# EAGLE design mush_indi_gnat (EAGLE 9.6.2)
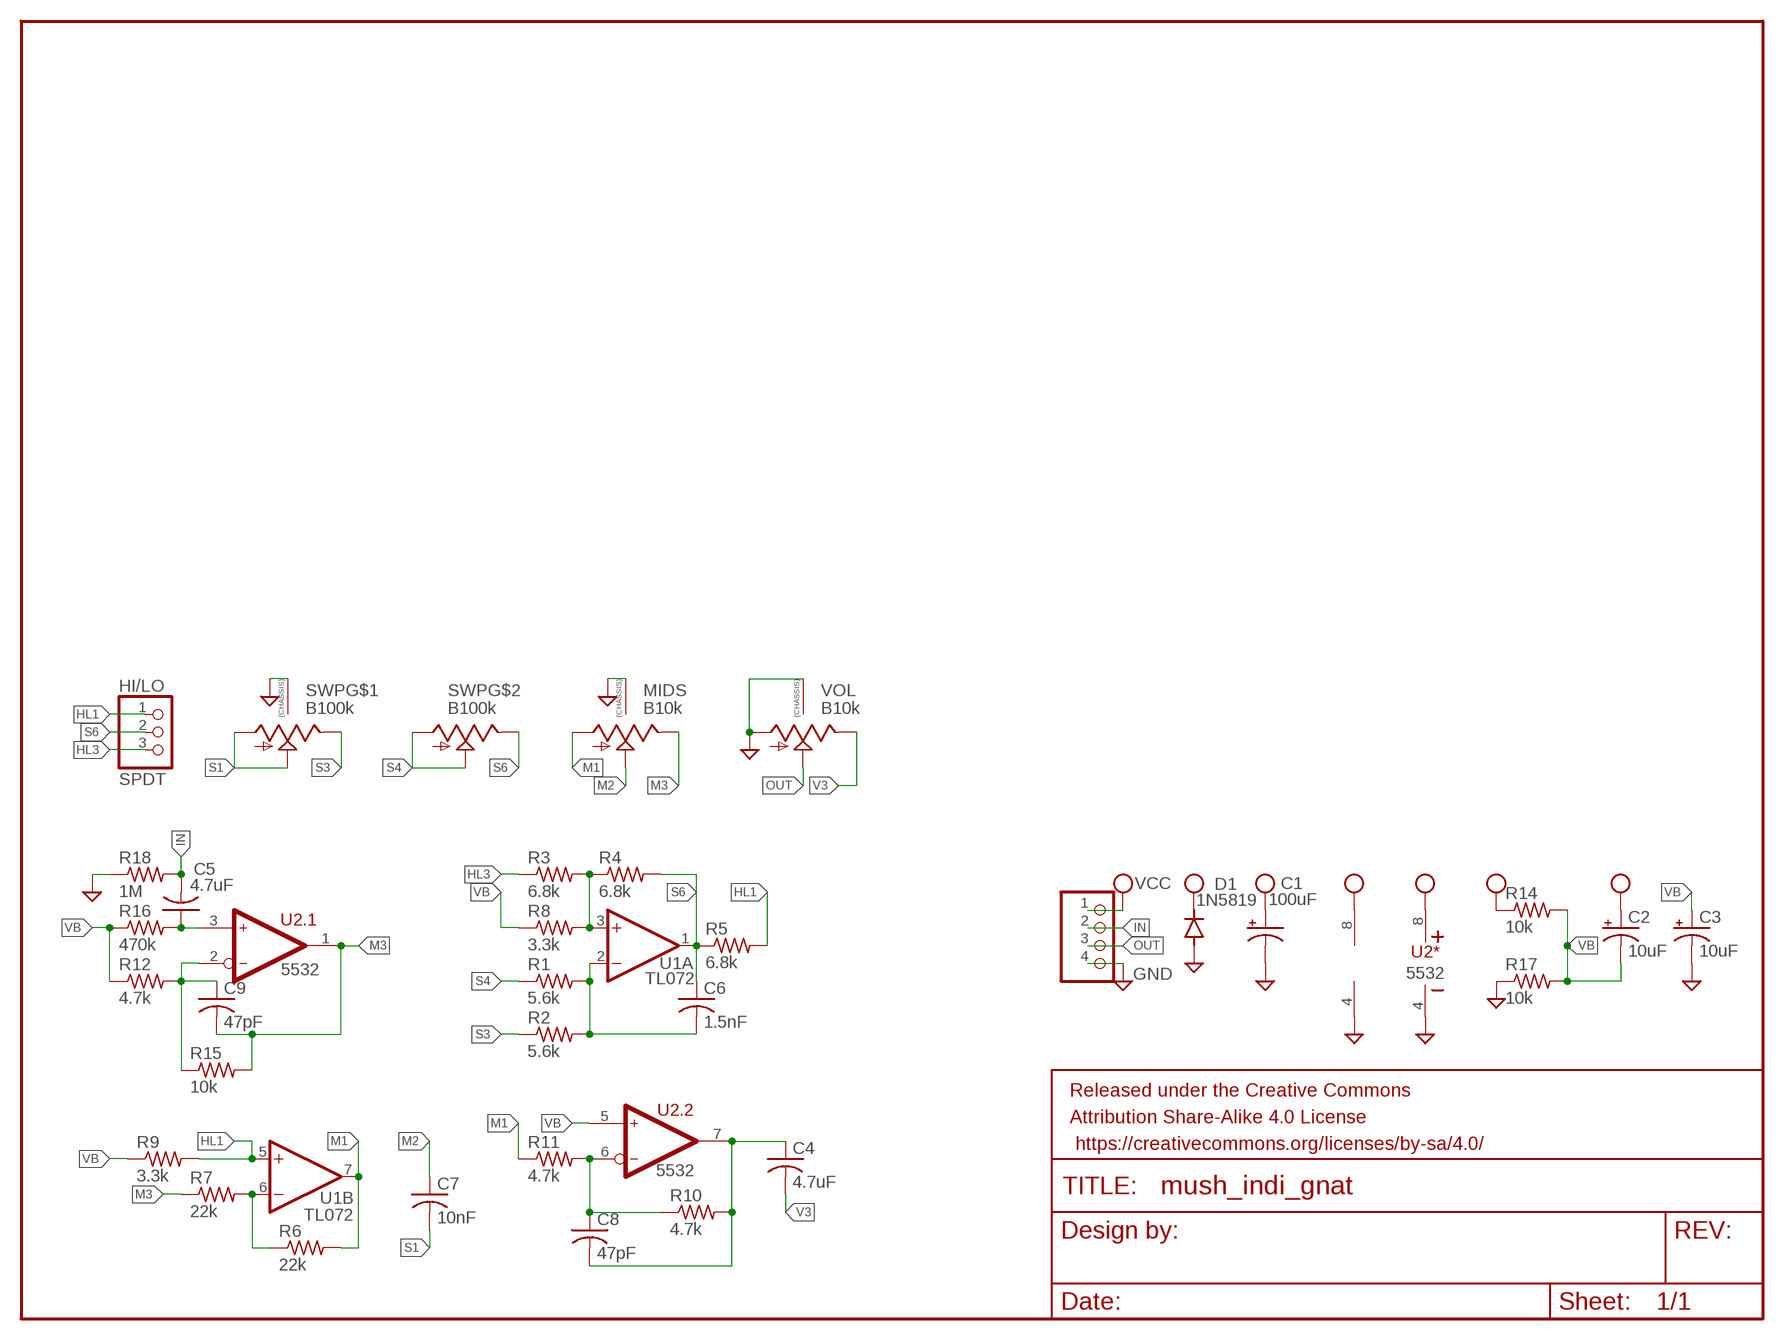
[diagram p0: schematic, sheet 1]

## Parts
C1  100uF  CAP_SMD+THRUPAN_B  [PAN_B_SMD+THRU]
C2  10uF  C-POL-US_TANTALUM-1206(3216-METRIC)  [CAPMP3216X180N]
C3  10uF  C-POL-US_TANTALUM-1206(3216-METRIC)  [CAPMP3216X180N]
C4  4.7uF  C-USC0805  [C0805]
C5  4.7uF  C-USC0805  [C0805]
C6  1.5nF  C-USC0603  [C0603]
C7  10nF  C-USC0603  [C0603]
C8  47pF  C-USC0603  [C0603]
C9  47pF  C-USC0603  [C0603]
D1  1N5819  DIODE-SOD123  [SOD123]
FRAME1  FRAME-LETTERNO_PACKAGE  [DUMMY]
HI/LO  SPDT  PINHD-1X3  [1X03]
JP1  PINHD-1X4  [1X04]
MIDS  B10k  9MM_SNAP-IN_POT_CHASSIS  [9MM_SNAP-IN_POT]
R1  5.6k  R-US_R0603  [R0603]
R2  5.6k  R-US_R0603  [R0603]
R3  6.8k  R-US_R0603  [R0603]
R4  6.8k  R-US_R0603  [R0603]
R5  6.8k  R-US_R0603  [R0603]
R6  22k  R-US_R0603  [R0603]
R7  22k  R-US_R0603  [R0603]
R8  3.3k  R-US_R0603  [R0603]
R9  3.3k  R-US_R0603  [R0603]
R10  4.7k  R-US_R0603  [R0603]
R11  4.7k  R-US_R0603  [R0603]
R12  4.7k  R-US_R0603  [R0603]
R14  10k  R-US_R0603  [R0603]
R15  10k  R-US_R0603  [R0603]
R16  470k  R-US_R0603  [R0603]
R17  10k  R-US_R0603  [R0603]
R18  1M  R-US_R0603  [R0603]
SWP  B100k  ALPHA-9MM-DUALPOT  [DUAL_9MM_SNAP-IN_POT]
U1  TL072  TL072TSSOP  [TSSOP-8]
U2  5532  NJM5532M  [SO-8]
VOL  B10k  9MM_SNAP-IN_POT_CHASSIS  [9MM_SNAP-IN_POT]

## Nets
GND: C1.- C1.--(-) C3.2(-) D1.A JP1.4 MIDS.CHASSIS1 MIDS.CHASSIS2 R17.1 R18.1 SWP.CHASSIS1 SWP.CHASSIS2 U1.4(P:V-) U2.4(*:V-) VOL.1(A) VOL.CHASSIS1 VOL.CHASSIS2
HL1: HI/LO.1 R5.2 R9.2 U1.5(B:+IN)
HL3: HI/LO.3 R3.1
IN: C5.2 JP1.2 R18.2
M1: MIDS.1(A) R6.2 R11.1 U1.7(B:OUT)
M2: C7.1 MIDS.2(S)
M3: C9.2 MIDS.3(E) R7.1 R15.2 U2.1(.1:OUT)
N$2: C5.1 R16.2 U2.3(.1:IN+)
N$3: C9.1 R12.2 R15.1 U2.2(.1:IN-)
N$4: R6.1 R7.2 U1.6(B:-IN)
N$5: R3.2 R4.1 R8.2 U1.3(A:+IN)
N$6: C6.2 R1.2 R2.2 U1.2(A:-IN)
N$7: C8.1 R10.1 R11.2 U2.6(.2:IN-)
N$8: C4.1 C8.2 R10.2 U2.7(.2:OUT)
OUT: JP1.3 VOL.2(S)
S1: C7.2 SWP.1(A) SWP.2(S)
S3: R2.1 SWP.3(E)
S4: R1.1 SWP.1B(A) SWP.2B(S)
S6: C6.1 HI/LO.2 R4.2 R5.1 SWP.3B(E) U1.1(A:OUT)
V3: C4.2 VOL.3(E)
VB: C2.2(-) C3.1(+) R8.1 R9.1 R12.1 R14.2 R16.1 R17.2 U2.5(.2:IN+)
VCC: C1.+ C1.++(+) C2.1(+) D1.C JP1.1 R14.1 U1.8(P:V+) U2.8(*:V+)

## Library data of the parts
C1 = MusicThingModular:CAP_SMD+THRU
C2 C3 = Capacitor:C-POL-US: Capacitor Polarised - ANSI; CATEGORY: Capacitor
C4-C9 = adafruit:C-US: CAPACITOR, American symbol
D1 = diode:DIODE-: DIODE
FRAME1 = SparkFun-Aesthetics:FRAME-LETTER: Schematic Frame - Letter Standard 8.5x11 US Letter frame; DESIGNER: Nobody; VERSION: v01
HI/LO = pinhead:PINHD-1X3: PIN HEADER
JP1 = Connector:PINHD-1X4: PIN HEADER; CATEGORY: CONNECTOR; SUB-CATEGORY: PIN-HEADER
MIDS VOL = MusicThingModular:9MM_SNAP-IN_POT_CHASSIS: 9mm vertical snap-in pot, Alpha / Panasonic style, with a connection to the metal chassis for grounding
R1-R12 R14-R18 = adafruit:R-US_: RESISTOR, American symbol
SWP = MusicThingModular:ALPHA-9MM-DUALPOT: 9mm vertical snap-in pot, Alpha / Panasonic style, with a connection to the metal chassis for grounding
U1 = MusicThingModular:TL072: Generic Dual Op Amp
U2 = ic-jrc:NJM5532; MOUSER: 513-NJM5532M

## Board
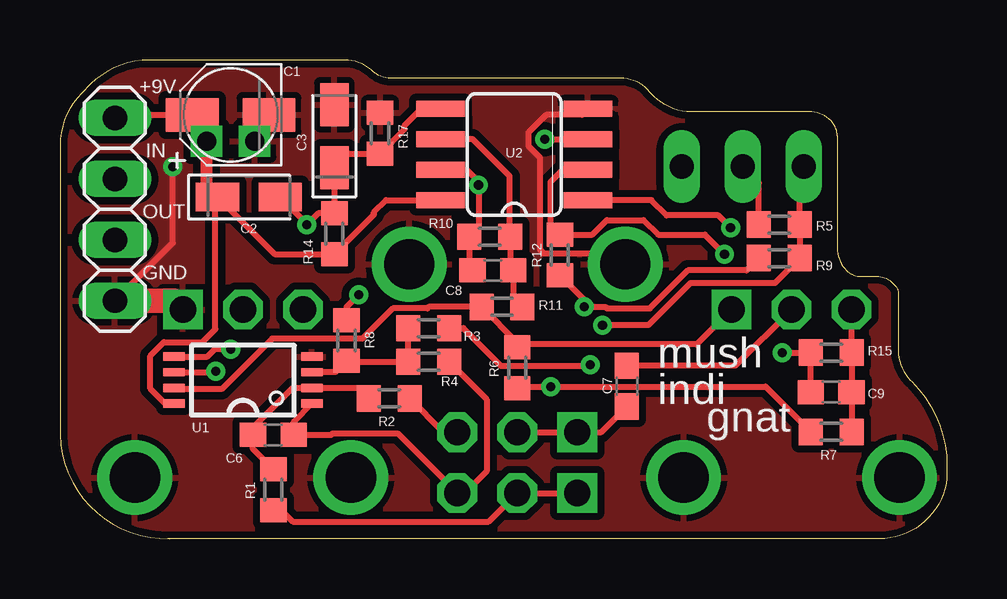
[diagram p1: board, top side]
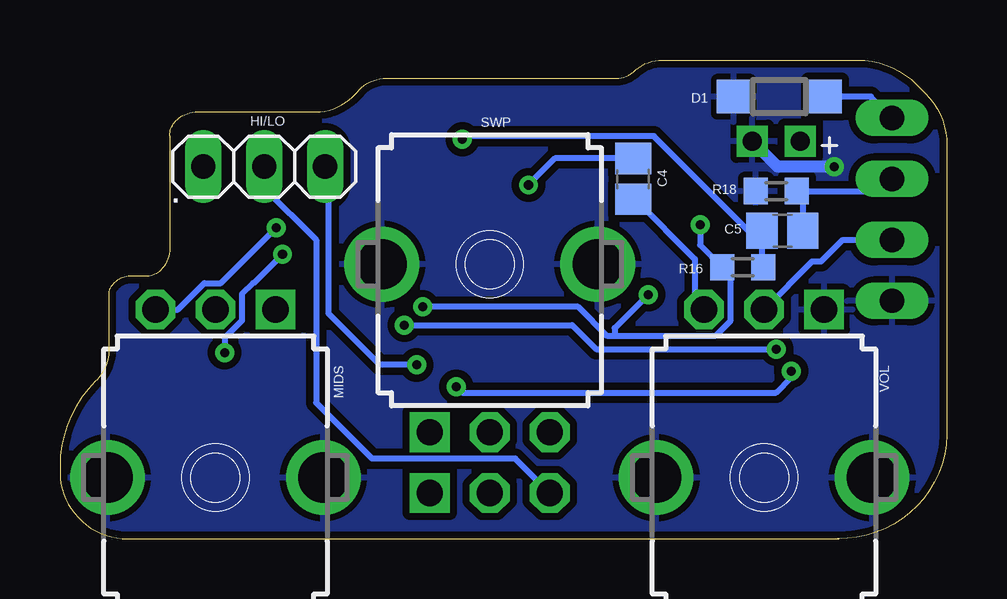
[diagram p2: board, bottom side, seen from below]

Size 36.96 x 19.94 mm. Coordinates in mm from the lower left corner, seen from the top.
Outline: 0,16.12 0,4.32
Outline: 4.5,0 34.35,0 arc45 36.2,0.89 arc45 36.96,2.73 36.96,3.01 arc45 35.49,6.54 35.43,6.6 arc-45 34.92,7.83 34.92,10.23 arc45 34.8,10.54 34.69,10.65 arc45 34.04,10.92 33.38,10.92 arc-45 32.77,11.18 arc-45 32.38,12.1 32.38,16.79 arc45 32.13,17.4 arc45 31.21,17.78 26.3,17.78 arc-45 24.77,18.41 24.58,18.6 arc45 23.5,19.18 14,19.18 arc-45 13.08,19.43 arc45 11.86,19.94 3.72,19.94 arc45 1.27,18.92 0.9,18.55 arc45 0,16.38 0,4.32
Outline: 0,4.32 arc90 4.57,0
Copper layers (1*16): Top 0.035mm / dielectric 1.5mm / Bottom 0.035mm
Design rules "default *": minimum track width 6mil, minimum drill 0.35mm, track to track 6mil, track to pad 6mil, pad to pad 6mil, via to via 6mil, smd to smd 6mil, copper to edge 10mil, drill to drill 6mil, minimum pad ring 10mil, minimum via ring 8mil, stop-mask expansion 4mil, vias tented up to drill 0mil, thermal gap 10mil

### Footprints (pad centres in the part's own frame; a part is rotated, then mirrored left to right if it is on the bottom)
PAN_B_SMD+THRU = smd 2.2 x 1.4: + 1.6,0; - -1.6,0 | drill 0.8 pad 0.9 square: ++ 1,1.1; -- -1,1.1
CAPMP3216X180N = smd 1.796 x 1.189: 1 -1.31,0; 2 1.31,0
C0805 = smd 1.3 x 1.5: 1 -0.85,0; 2 0.85,0
C0603 = smd 1.1 x 1: 1 -0.85,0; 2 0.85,0
SOD123 = smd 1.4 x 1.4: A 1.9,0; C -1.9,0
1X03 = drill 1.016 long: 1 -2.54,0; 2 0,0; 3 2.54,0
1X04 = drill 1.016 long: 1 -3.81,0; 2 -1.27,0; 3 1.27,0; 4 3.81,0
9MM_SNAP-IN_POT = drill 1.1 square: 1 -2.5,-7 | drill 1.1 octagon: 2 0,-7; 3 2.5,-7 | drill 2.1 pad 2.794: CHASSIS1 -4.5,0; CHASSIS2 4.5,0
R0603 = smd 1 x 1.1: 1 -0.85,0; 2 0.85,0
DUAL_9MM_SNAP-IN_POT = drill 1.1 square: 1 -2.5,-7; 1B -2.5,-9.54 | drill 1.1 octagon: 2 0,-7; 2B 0,-9.54; 3 2.5,-7; 3B 2.5,-9.54 | drill 2.1 pad 2.54: CHASSIS1 -4.5,0; CHASSIS2 4.5,0
TSSOP-8 = smd 0.9 x 0.35: 1 -2.875,0.975; 2 -2.875,0.325; 3 -2.875,-0.325; 4 -2.875,-0.975; 5 2.875,-0.975; 6 2.875,-0.325; 7 2.875,0.325; 8 2.875,0.975
SO-8 = smd 0.66 x 2.032: 1 -1.905,-3.073; 2 -0.635,-3.073; 3 0.635,-3.073; 4 1.905,-3.073; 5 1.905,3.073; 6 0.635,3.073; 7 -0.635,3.073; 8 -1.905,3.073

### Placement (x,y rotation side)
C1  7.11,17.65 180 top
C2  7.87,14.22 0 top
C3  11.43,16.76 90 top
C4  13.08,14.99 270 bottom
C5  6.86,12.83 0 bottom
C6  8.89,4.32 180 top
C7  23.62,6.35 270 top
C8  18.03,11.18 180 top
C9  32.13,6.1 0 top
D1  6.99,18.41 180 bottom
FRAME1  -20.32,-22.86 0 top  (outside the outline)
HI/LO  28.45,15.49 0 bottom
JP1  2.29,13.72 270 top
MIDS  30.48,2.54 180 bottom
R1  8.89,2.03 90 top
R2  13.72,5.84 180 top
R3  15.37,8.76 180 top
R4  15.37,7.37 0 top
R5  29.97,13.08 0 top
R6  19.05,7.11 90 top
R7  32.13,4.45 180 top
R8  11.94,8.26 270 top
R9  29.97,11.68 0 top
R10  17.91,12.57 180 top
R11  18.41,9.65 0 top
R12  20.83,11.81 90 top
R14  11.43,12.7 90 top
R15  32.13,7.75 0 top
R16  8.51,11.3 0 bottom
R17  13.34,16.89 270 top
R18  7.11,14.48 0 bottom
SWP  19.05,11.43 0 bottom
U1  7.62,6.6 180 top
U2  18.92,16 90 top
VOL  7.62,2.54 180 bottom

### Tracks (layer width: path | path; a pad name or v marks a point on that pad's centre or on a via)
GND  (via drill 0.38)
  Top 0.254: U2.4 21.74,17.65 20.26,17.65 19.52,16.92 19.52,16.36 20,15.88 20,12.04 20.16,11.88 23.1,11.88 SWP.CHASSIS1 | JP1.4 4.7,12.32 v4.7,15.49
  Top 1.016: JP1.4 4.75,9.91 VOL.1
  Bottom 0.508: v4.7,15.49 5.29,15.49 7.05,15.49 C1.--
  pour Bottom (isolate 0.305): -2.54,-1.27 39.37,-1.27 39.37,21.59 -1.27,21.59 -2.54,20.32
  pour Top (isolate 0.305): -2.54,-1.27 39.37,-1.27 39.37,21.59 -1.27,21.59 -2.54,20.32
HL1  (via drill 0.38)
  Top 0.254: HI/LO.1 30.82,15.33 R5.2 R9.2 29.78,10.64 26.27,10.64 24.51,8.89 v22.61,8.89 | v7.11,7.89 6.45,7.89 6.14,7.58 U1.5
  Bottom 0.254: v22.61,8.89 15.62,8.89 14.62,7.89 v7.11,7.89
HL3  (via drill 0.38)
  Top 0.254: R3.1 16.8,8.76 18.38,7.18 22.04,7.18 v22.1,7.24
  Bottom 0.254: HI/LO.3 25.77,15.35 25.77,9.37 23.64,7.24 v22.1,7.24
IN
  Bottom 0.254: C5.2 6.01,14.22 R18.2 2.79,14.48 JP1.2
M1
  Top 0.254: U1.7 4.8,6.22 6.73,6.22 8.83,8.33 12.6,8.33 13.87,9.59 15.31,9.59 15.37,9.65 R11.1 19.05,8.17 R6.2 19.18,8.09 26.53,8.09 MIDS.1
M2
  Top 0.254: MIDS.2 28.14,7.2 C7.1
M3  (via drill 0.38)
  Top 0.254: MIDS.3 R15.2 C9.2 R7.1 | v27.94,12.95 27.43,13.46 25.27,13.46 24.64,14.1 U2.1
  Bottom 0.254: MIDS.3 32.04,9.54 30.94,10.64 30.25,10.64 v27.94,12.95
N$2  (via drill 0.38)
  Top 0.254: v20.19,16.64 U2.3
  Bottom 0.254: v20.19,16.64 20.17,16.64 20.04,16.77 12.21,16.77 8.28,12.83 C5.1 7.71,11.35 R16.2
N$3  (via drill 0.38)
  Top 0.254: C9.1 R15.1 v30.1,7.75 | U2.2 20.95,15.37 20.45,14.86 20.45,13.04 R12.2 22.18,12.66 22.79,13.27 24.31,13.27 24.92,12.66 26.87,12.66 v27.69,11.85
  Bottom 0.254: v27.69,11.85 28.89,10.64 28.92,10.64 29.38,10.19 29.38,9.08 30.1,8.36 v30.1,7.75
N$4  (via drill 0.38)
  Top 0.254: R6.1 19.26,6.26 19.32,6.33 v20.45,6.33 29.4,6.33 R7.2 | U1.6 6.44,6.93 v6.49,6.97
  Bottom 0.254: v6.49,6.97 6.49,6.72 7.12,6.08 20.2,6.08 v20.45,6.33
N$5
  Top 0.254: R3.2 R4.1 11.98,7.37 R8.2 11.46,6.93 U1.3
N$6
  Top 0.254: R2.2 12.43,6.28 U1.2 9.71,6.28 8.04,4.61 C6.2 8.04,3.73 R1.2
N$7
  Top 0.254: U2.6 17.2,16.64 18.73,15.1 18.73,12.6 R10.1 18.76,11.3 C8.1 18.88,10.03 R11.2
N$8  (via drill 0.38)
  Top 0.254: U2.7 16.94,15.37 17.44,14.87 v17.44,14.73 17.44,12.95 R10.2 17.06,11.3 C8.2
  Bottom 0.254: C4.1 16.33,15.84 v17.44,14.73
OUT
  Bottom 0.254: VOL.2 5.62,11.54 5.24,11.54 4.34,12.45 JP1.3
S1
  Top 0.254: SWP.2 SWP.1 22.55,4.43 C7.2
S3
  Top 0.254: SWP.3 15.98,4.43 R2.1
S4
  Top 0.254: R1.1 9.23,1.18 9.71,0.7 17.86,0.7 SWP.2B SWP.1B
S6
  Top 0.254: U1.1 9.74,4.87 C6.1 11.3,4.32 11.36,4.38 14.06,4.38 16.46,1.98 | 16.46,1.98 SWP.3B | R5.1 29.12,14.82 HI/LO.2 | R4.2 17.78,5.8 17.78,2.79 16.97,1.98 16.46,1.98
  Bottom 0.254: SWP.3B 17.99,3.33 23.95,3.33 26.29,5.66 26.29,12.45 28.45,14.61 HI/LO.2
V3
  Bottom 0.254: VOL.3 10.5,9.92 10.5,11.64 12.99,14.14 C4.2
VB  (via drill 0.38)
  Top 0.254: C2.2 10.29,13.12 v10.29,13.08 10.76,13.55 R14.2 C3.1 12.02,16.04 R17.2 14.35,17.06 14.35,17.2 15.06,17.91 U2.5 | R12.1 21.84,9.95 v21.84,9.65 22.73,9.65 22.79,9.59 24.58,9.59 26.16,11.18 28.61,11.18 R9.1 | R8.1 11.94,9.65 v12.45,10.16
  Bottom 0.254: v21.84,9.65 15.37,9.65 14.15,8.44 13.84,8.44 | 13.84,8.44 9.66,8.44 9.02,9.08 9.02,10.96 R16.1 10.29,12.23 v10.29,13.08 | v12.45,10.16 13.84,8.76 13.84,8.44
VCC
  Top 0.254: JP1.1 2.41,17.65 5.08,17.65 | 5.08,17.65 C1.+ | C1.++ 6.11,16.62 5.08,17.65 | C2.1 6.65,14.14 | 6.65,14.14 8.94,11.85 R14.1 13.08,13.5 13.08,13.59 13.59,14.1 U2.8 | U1.8 4.38,5.63 3.76,6.24 3.76,7.62 4.33,8.18 5.93,8.18 6.48,8.73 6.48,13.97 6.65,14.14
  Top 0.508: C2.1 6.11,14.68 C1.++
  Bottom 0.254: JP1.1 3.17,18.41 D1.C

### Text on the board
tPlace: +9V | IN | OUT | GND | mush | indi | gnat
bPlace: .